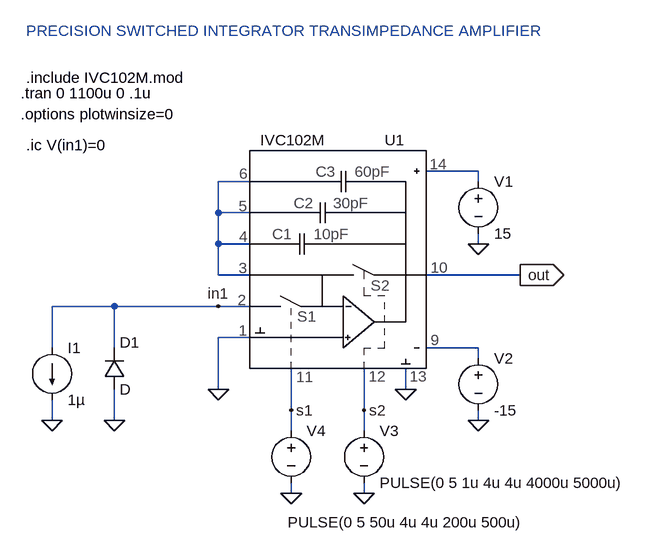
[diagram p0: schematic IVC102_test.asc]
IVC102_test.asc, the LTspice schematic file:
Version 4
SHEET 1 880 680
WIRE 464 112 384 112
WIRE 112 128 64 128
WIRE 464 128 464 112
WIRE 64 176 64 128
WIRE 112 176 64 176
WIRE 64 224 64 176
WIRE 112 224 64 224
WIRE 464 224 464 208
WIRE 64 272 64 224
WIRE 112 272 64 272
WIRE 528 272 384 272
WIRE -96 320 -192 320
WIRE 64 320 -96 320
WIRE 112 320 64 320
WIRE 112 368 64 368
WIRE -192 384 -192 320
WIRE -96 384 -96 320
WIRE 464 384 384 384
WIRE 464 400 464 384
WIRE 64 448 64 368
WIRE 352 448 352 416
WIRE 176 480 176 416
WIRE 288 480 288 416
WIRE -192 496 -192 464
WIRE -96 496 -96 448
WIRE 464 496 464 480
WIRE 176 512 176 480
WIRE 288 512 288 480
WIRE 176 608 176 592
WIRE 288 608 288 592
FLAG 464 224 0
FLAG 464 496 0
FLAG 352 448 0
FLAG 64 448 0
FLAG -192 496 0
FLAG 288 608 0
FLAG 176 608 0
FLAG 528 272 out
IOPIN 528 272 Out
FLAG 64 320 in1
FLAG -96 496 0
FLAG 176 480 s1
FLAG 288 480 s2
SYMBOL voltage 464 112 R0
SYMATTR InstName V1
SYMATTR Value 15
SYMBOL IVC102M 128 176 R0
SYMATTR InstName U1
SYMBOL voltage 464 384 R0
SYMATTR InstName V2
SYMATTR Value -15
SYMBOL voltage 288 496 R0
WINDOW 123 0 0 Left 0
WINDOW 39 0 0 Left 0
SYMATTR InstName V3
SYMATTR Value PULSE(0 5 1u 4u 4u 4000u 5000u)
SYMBOL voltage 176 496 R0
WINDOW 3 -5 157 Left 0
WINDOW 123 0 0 Left 0
WINDOW 39 0 0 Left 0
SYMATTR Value PULSE(0 5 50u 4u 4u 200u 500u)
SYMATTR InstName V4
SYMBOL current -192 384 R0
SYMATTR InstName I1
SYMATTR Value 1µ
SYMBOL diode -112 448 M180
WINDOW 0 24 72 Left 0
WINDOW 3 24 0 Left 0
SYMATTR InstName D1
TEXT -240 -8 Left 0 !.tran 0 1100u 0 .1u
TEXT -240 24 Left 0 !.options plotwinsize=0
TEXT -232 72 Left 0 !.ic V(in1)=0
TEXT -232 -32 Left 0 !.include IVC102M.mod
TEXT -232 -104 Left 0 ;PRECISION SWITCHED INTEGRATOR TRANSIMPEDANCE AMPLIFIER

The netlist it stands for:
* IVC102_test.asc
V1 N001 0 15
XU1 0 in1 N002 N002 N002 N002 N003 out s1 s2 0 N001 IVC102M  ; pins 11 10 9 8 7 6 12 17 13 14 15 16
V2 N003 0 -15
V3 s2 0 PULSE(0 5 1u 4u 4u 4000u 5000u)
V4 s1 0 PULSE(0 5 50u 4u 4u 200u 500u)
I1 in1 0 1µ
D1 0 in1 D
.model D D
.lib standard.dio
.tran 0 1100u 0 .1u
.options plotwinsize=0
.ic V(in1)=0
.include IVC102M.mod
* PRECISION SWITCHED INTEGRATOR TRANSIMPEDANCE AMPLIFIER
.backanno
.end